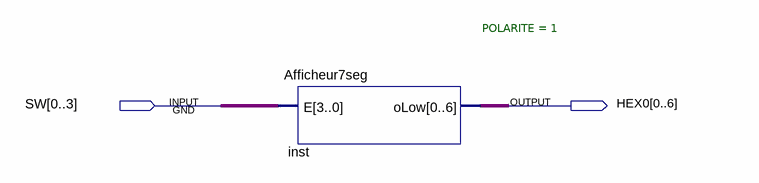
[diagram p0: schematic sheet]
// Quartus schematic AfficheurBlock.bdf as structural Verilog: 1 symbols, 2 pins
module AfficheurBlock (
  input  [0:3] SW,
  output [0:6] HEX0
);

  Afficheur7seg #(.POLARITE(1)) inst (.E(SW), .oLow(HEX0));
endmodule
